# Altium project bldc_v1.PrjPcb (part 2 of 2)

## Sheet controller.SchDoc
size A4; SheetNumber: 3; SheetTotal: 4
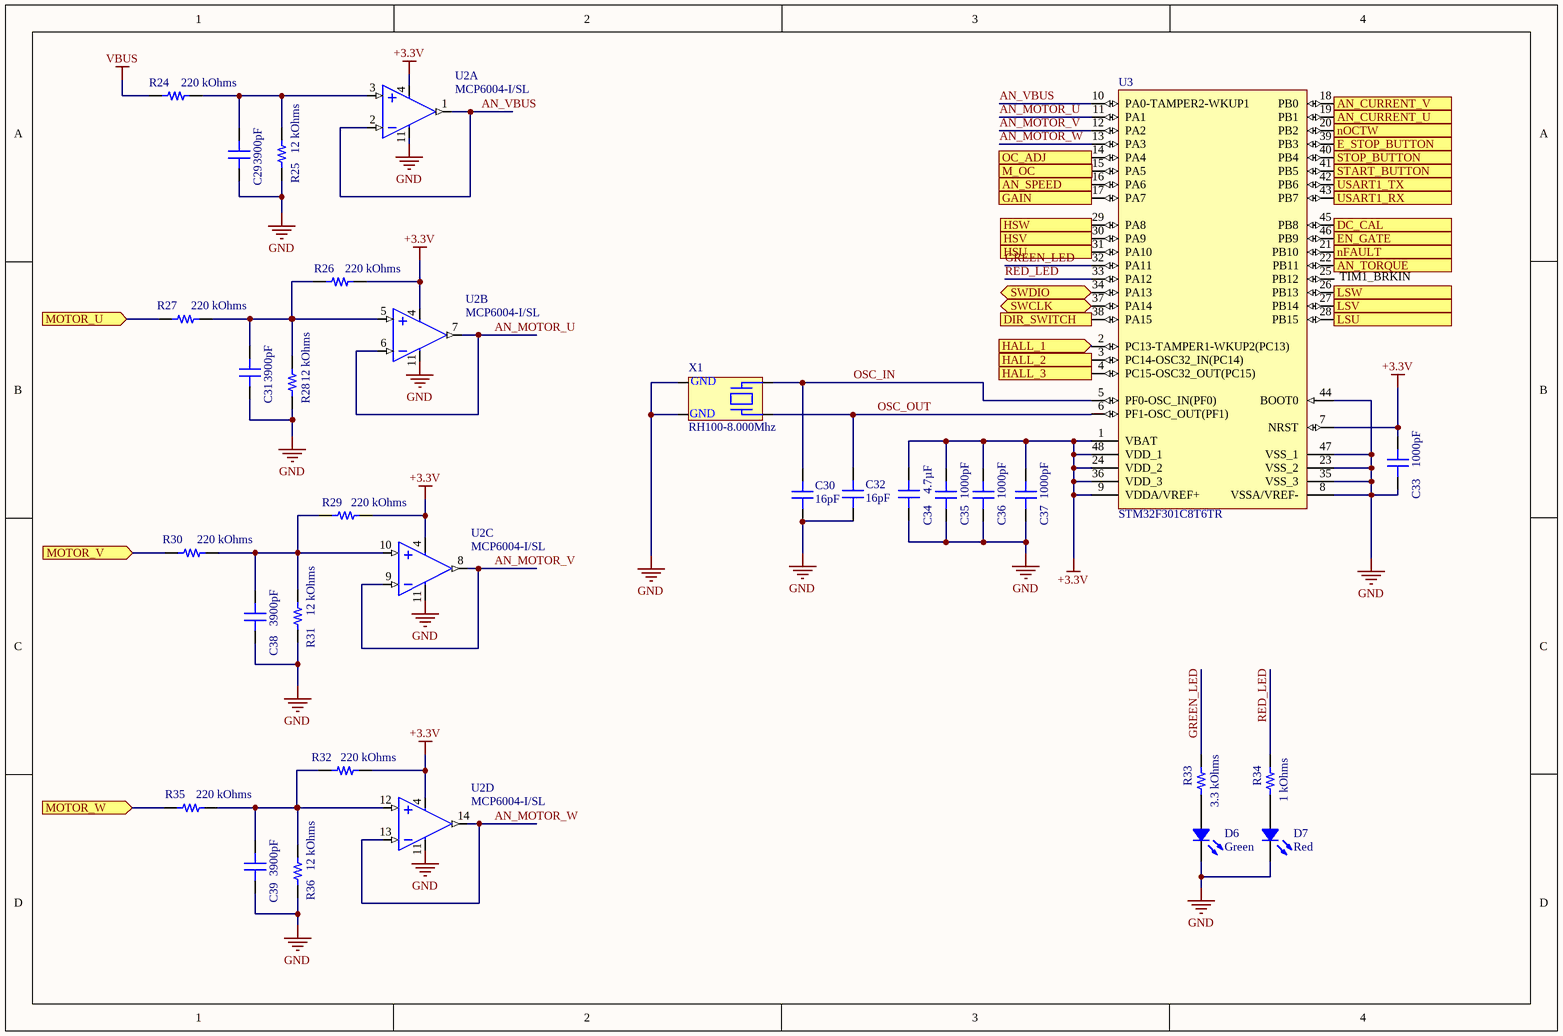
[diagram p2: controller.SchDoc]

### Parts
C29  3900pF  [CAP 0402_1005]
C30  16pF  [CAP 0402_1005]
C31  3900pF  [CAP 0402_1005]
C32  16pF  [CAP 0402_1005]
C33  1000pF  [CAP 0402_1005]
C34  4.7µF  [CAP 1206_3216 - 1.0MM]
C35  1000pF  [CAP 0402_1005]
C36  1000pF  [CAP 0402_1005]
C37  1000pF  [CAP 0402_1005]
C38  3900pF  [CAP 0402_1005]
C39  3900pF  [CAP 0402_1005]
D6  Green  [LED 1206_3216 GREEN]
D7  Red  [LED 1206_3216 RED]
R24  220 kOhms  [RES 1206_3216]
R25  12 kOhms  [RES 1206_3216]
R26  220 kOhms  [RES 1206_3216]
R27  220 kOhms  [RES 1206_3216]
R28  12 kOhms  [RES 1206_3216]
R29  220 kOhms  [RES 1206_3216]
R30  220 kOhms  [RES 1206_3216]
R31  12 kOhms  [RES 1206_3216]
R32  220 kOhms  [RES 1206_3216]
R33  3.3 kOhms  [RES 1206_3216]
R34  1 kOhms  [RES 1206_3216]
R35  220 kOhms  [RES 1206_3216]
R36  12 kOhms  [RES 1206_3216]
U2  MCP6004-I/SL  [SOIC-SL14_N]  (parts A,B,C,D of 4)
U3  STM32F301C8T6TR  [STM-LQFP48_H]
X1  RH100-8.000Mhz  [RH100-8.000]

### Ports
AN_CURRENT_U (in), AN_CURRENT_V (in), AN_SPEED (in), AN_TORQUE (in), DC_CAL (out), DIR_SWITCH (in), E_STOP_BUTTON (in), EN_GATE (out), GAIN (out), HALL_1 (in), HALL_2 (in), HALL_3 (in), HSU (out), HSV (out), HSW (out), LSU (out), LSV (out), LSW (out), M_OC (out), MOTOR_U (in), MOTOR_V (in), MOTOR_W (in), nFAULT (in), nOCTW (in), OC_ADJ (out), START_BUTTON (in), STOP_BUTTON (in), SWCLK (bidir), SWDIO (bidir), USART1_RX (in), USART1_TX (out)

### Nets
+3.3V: C33.2 C34.2 C35.2 C36.2 C37.2 R26.1 R29.1 R32.1 U2.4(VDD) U3.1(VBAT) U3.7(NRST) U3.9(VDDA/VREF+) U3.24(VDD_2) U3.36(VDD_3) U3.48(VDD_1)
GND: C29.1 C30.2 C31.1 C32.2 C33.1 C34.1 C35.1 C36.1 C37.1 C38.1 C39.1 D6.2 D7.2 R25.1 R28.1 R31.1 R36.1 U2.11(VSS) U3.8(VSSA/VREF-) U3.23(VSS_2) U3.35(VSS_3) U3.44(BOOT0) U3.47(VSS_1) X1.1(GND) X1.3(GND)
VBUS: R24.2
AN_MOTOR_U: U2.6(VINB-) U2.7(VOUTB) U3.11(PA1)
AN_MOTOR_V: U2.8(VOUTC) U2.9(VINC-) U3.12(PA2)
AN_MOTOR_W: U2.13(VIND-) U2.14(VOUTD) U3.13(PA3)
AN_VBUS: U2.1(VOUTA) U2.2(VINA-) U3.10(PA0-TAMPER2-WKUP1)
GREEN_LED: R33.2 U3.32(PA11)
HALL_A: U3.2(PC13-TAMPER1-WKUP2(PC13)) ; port HALL_1
HALL_B: U3.3(PC14-OSC32_IN(PC14)) ; port HALL_2
HALL_C: U3.4(PC15-OSC32_OUT(PC15)) ; port HALL_3
M_U: R27.2 ; port MOTOR_U
M_V: R30.2 ; port MOTOR_V
M_W: R35.2 ; port MOTOR_W
OSC_IN: C30.1 U3.5(PF0-OSC_IN(PF0)) X1.4(X1)
OSC_OUT: C32.1 U3.6(PF1-OSC_OUT(PF1)) X1.2(X2)
RED_LED: R34.2 U3.33(PA12)
NetC29_2: C29.2 R24.1 R25.2 U2.3(VINA+)
NetC31_2: C31.2 R26.2 R27.1 R28.2 U2.5(VINB+)
NetC38_2: C38.2 R29.2 R30.1 R31.2 U2.10(VINC+)
NetC39_2: C39.2 R32.2 R35.1 R36.2 U2.12(VIND+)
NetC40_2: U3.16(PA6) ; port AN_SPEED
NetC41_2: U3.22(PB11) ; port AN_TORQUE
NetCON1_3: U3.14(PA4) ; port OC_ADJ
NetCON9_1: U3.34(PA13) ; port SWDIO
NetCON9_3: U3.37(PA14) ; port SWCLK
NetD6_1: D6.1 R33.1
NetD7_1: D7.1 R34.1
NetIC1_5: U3.20(PB2) ; port nOCTW
NetIC1_6: U3.21(PB10) ; port nFAULT
NetIC1_9: U3.15(PA5) ; port M_OC
NetIC1_10: U3.17(PA7) ; port GAIN
NetIC1_12: U3.45(PB8) ; port DC_CAL
NetIC1_16: U3.46(PB9) ; port EN_GATE
NetIC1_17: U3.31(PA10) ; port HSU
NetIC1_18: U3.28(PB15) ; port LSU
NetIC1_19: U3.29(PA8) ; port HSW
NetIC1_20: U3.26(PB13) ; port LSW
NetIC1_21: U3.30(PA9) ; port HSV
NetIC1_22: U3.27(PB14) ; port LSV
NetIC1_25: U3.19(PB1) ; port AN_CURRENT_U
NetIC1_26: U3.18(PB0) ; port AN_CURRENT_V
NetR42_2: U3.41(PB5) ; port START_BUTTON
NetR46_2: U3.40(PB4) ; port STOP_BUTTON
NetR50_2: U3.39(PB3) ; port E_STOP_BUTTON
NetR52_2: U3.38(PA15) ; port DIR_SWITCH
NetU3_42: U3.42(PB6) ; port USART1_TX
NetU3_43: U3.43(PB7) ; port USART1_RX

Not connected (* = marked no-connect by the designer): U3 25(PB12)

### Notes on the sheet
- (near U3) TIM1_BRKIN

### Library data of the parts
C29 C31 C38 C39 = CC0402JRX7R9BB392: CAP CER 3900PF 50V X7R 0402; Manufacturer: Yageo; Tolerance: ±5%; Part Number: CC0402JRX7R9BB392; Value: 3900pF; Applications: General Purpose; Capacitance: 3900pF; ComponentLink1Description: Datasheet; ComponentLink1URL: https://www.yageo.com/upload/media/product/productsearch/datasheet/mlcc/UPY-GPHC_X7R_6.3V-to-50V_18.pdf; ComponentLink2Description: DigiKey Link; ComponentLink2URL: http://digikey.com/product-detail/en/yageo/CC0402JRX7R9BB392/311-3771-1-ND/8024860; Device Package: 0402 (1005 Metric); LastUpdated: 9/2/2020 1:02:24 AM; Lifecycle Status: Active; Minimum Order: 1; Mounting Type: Surface Mount, MLCC; Operating Temperature: -55°C ~ 125°C; Package / Case: 0402 (1005 Metric); Packaging: TapeAndReel; PartId: 1941; Part Status: Active; Price: 0.01; Series: CC; Size / Dimension: 0.039" L x 0.020" W (1.00mm x 0.50mm); Supplier 1: DigiKey; Supplier Part Number 1: 311-3771-1-ND; Temperature Coefficient: X7R; Thickness (Max): 0.022" (0.55mm); Voltage - Rated: 50V
C30 C32 = CBR04C160F5GAC: CAP CER 16PF 50V C0G/NP0 0402; Manufacturer: KEMET; Temperature Coefficient: C0G, NP0; Tolerance: ±1%; Part Number: CBR04C160F5GAC; Value: 16pF; Applications: RF, Microwave, High Frequency; Capacitance: 16pF; ComponentLink1Description: Datasheet; ComponentLink1URL: https://api.kemet.com/component-edge/download/datasheet/CBR04C160F5GAC.pdf; ComponentLink2Description: DigiKey Link; ComponentLink2URL: http://digikey.com/product-detail/en/kemet/CBR04C160F5GAC/399-8829-1-ND/3479748; Device Package: 0402 (1005 Metric); Features: High Q, Low Loss, Ultra Low ESR; LastUpdated: 9/2/2020 1:02:25 AM; Lifecycle Status: Active; Minimum Order: 1; Mounting Type: Surface Mount, MLCC; Operating Temperature: -55°C ~ 125°C; Package / Case: 0402 (1005 Metric); Packaging: TapeAndReel; PartId: 1751; Part Status: Active; Price: 0.08; Series: CBR-SMD RF C0G; Size / Dimension: 0.039" L x 0.020" W (1.00mm x 0.50mm); Supplier 1: DigiKey; Supplier Part Number 1: 399-8829-1-ND; Thickness (Max): 0.022" (0.55mm); Voltage - Rated: 50V
C33 C35-C37 = CGJ2B2X7R1E102K050BA: CAP CER 1000PF 25V X7R 0402; Manufacturer: TDK Corporation; Tolerance: ±10%; Part Number: CGJ2B2X7R1E102K050BA; Value: 1000pF; Applications: Automotive; Capacitance: 1000pF; ComponentLink1Description: Datasheet; ComponentLink1URL: https://product.tdk.com/info/en/catalog/datasheets/mlcc_highreliability_general_en.pdf?ref_disty=digikey; ComponentLink2Description: DigiKey Link; ComponentLink2URL: http://digikey.com/product-detail/en/tdk-corporation/CGJ2B2X7R1E102K050BA/445-8072-1-ND/2812108; Device Package: 0402 (1005 Metric); LastUpdated: 9/2/2020 1:02:23 AM; Lifecycle Status: Active; Minimum Order: 1; Mounting Type: Surface Mount, MLCC; Operating Temperature: -55°C ~ 125°C; Package / Case: 0402 (1005 Metric); Packaging: TapeAndReel; PartId: 2275; Part Status: Active; Price: 0.02; Ratings: AEC-Q200; Series: CGJ; Size / Dimension: 0.039" L x 0.020" W (1.00mm x 0.50mm); Supplier 1: DigiKey; Supplier Part Number 1: 445-8072-1-ND; Temperature Coefficient: X7R; Thickness (Max): 0.022" (0.55mm); Voltage - Rated: 25V
C34 = C3216X7R1E475K085AB: CAP CER 4.7UF 25V X7R 1206; Manufacturer: TDK Corporation; Tolerance: ±10%; Part Number: C3216X7R1E475K085AB; Value: 4.7µF; Applications: General Purpose; Capacitance: 4.7µF; ComponentLink1Description: Datasheet; ComponentLink1URL: https://product.tdk.com/info/en/catalog/datasheets/mlcc_commercial_general_en.pdf?ref_disty=digikey; ComponentLink2Description: DigiKey Link; ComponentLink2URL: http://digikey.com/product-detail/en/tdk-corporation/C3216X7R1E475K085AB/445-14797-1-ND/3956463; Device Package: 1206 (3216 Metric); Features: Low ESL; LastUpdated: 9/2/2020 1:05:06 AM; Lifecycle Status: Active; Minimum Order: 1; Mounting Type: Surface Mount, MLCC; Operating Temperature: -55°C ~ 125°C; Package / Case: 1206 (3216 Metric); Packaging: TapeAndReel; PartId: 19105; Part Status: Active; Price: 0.08; Series: C; Size / Dimension: 0.126" L x 0.063" W (3.20mm x 1.60mm); Supplier 1: DigiKey; Supplier Part Number 1: 445-14797-1-ND; Temperature Coefficient: X7R; Thickness (Max): 0.039" (1.00mm); Voltage - Rated: 25V
D6 = SML-LX1206SUGC-TR: LED GREEN CLEAR 1206 SMD; Manufacturer: Lumex Opto/Components Inc.; Configuration: Standard; Current - Test: 20mA; Lens Color: Colorless; Lens Size: 2.00mm x 1.50mm; Lens Style: Rectangle with Flat Top; Millicandela Rating: 45mcd; Viewing Angle: 140°; Voltage - Forward (Vf) (Typ): 2.2V; Wavelength - Peak: 574nm; Part Number: SML-LX1206SUGC-TR; Color: Green; ComponentLink1Description: Datasheet; ComponentLink1URL: https://www.lumex.com/content/files/ProductAttachment/SML-LX1206SUGC-TR.pdf; ComponentLink2Description: DigiKey Link; ComponentLink2URL: http://digikey.com/product-detail/en/lumex-opto-components-inc/SML-LX1206SUGC-TR/67-1698-1-ND/467582; Device Package: 1206 (3216 Metric); Height (Max): 1.10mm; LastUpdated: 9/2/2020 1:20:47 AM; Lens Transparency: Clear; Lifecycle Status: Active; Minimum Order: 1; Mounting Type: Surface Mount; Package / Case: 1206 (3216 Metric); Packaging: TapeAndReel; PartId: 530; Part Status: Active; Price: 0.09; Series: -; Size / Dimension: 3.20mm L x 1.60mm W; Supplier 1: DigiKey; Supplier Part Number 1: 67-1698-1-ND; Supplier Device Package: 1206; Value: Green
D7 = AP3216SURCK: LED RED CLEAR CHIP SMD; Manufacturer: Kingbright; Configuration: Standard; Current - Test: 20mA; Lens Color: Colorless; Lens Size: 2.00mm x 1.60mm; Lens Style: Rectangle with Flat Top; Millicandela Rating: 80mcd; Viewing Angle: 120°; Voltage - Forward (Vf) (Typ): 1.95V; Wavelength - Dominant: 630nm; Wavelength - Peak: 650nm; Part Number: AP3216SURCK; Color: Red; ComponentLink1Description: Datasheet; ComponentLink1URL: http://www.kingbrightusa.com/images/catalog/SPEC/AP3216SURCK.pdf; ComponentLink2Description: DigiKey Link; ComponentLink2URL: http://digikey.com/product-detail/en/kingbright/AP3216SURCK/754-2162-1-ND/7708877; Device Package: 1206 (3216 Metric); Height (Max): 1.10mm; LastUpdated: 9/2/2020 1:21:09 AM; Lens Transparency: Clear; Lifecycle Status: Active; Minimum Order: 1; Mounting Type: Surface Mount; Package / Case: 1206 (3216 Metric); Packaging: TapeAndReel; PartId: 191; Part Status: Active; Price: 0.07; Series: -; Size / Dimension: 3.20mm L x 1.60mm W; Supplier 1: DigiKey; Supplier Part Number 1: 754-2162-1-ND; Supplier Device Package: Chip LED; Value: Red
R24 R26 R27 R29 R30 R32 R35 = AC1206FR-07220KL: RES SMD 220K OHM 1% 1/4W 1206; Manufacturer: Yageo; Power (Watts): 0.25W, 1/4W; Temperature Coefficient: ±100ppm/°C; Part Number: AC1206FR-07220KL; ComponentLink1Description: Datasheet; ComponentLink1URL: https://www.yageo.com/upload/media/product/productsearch/datasheet/rchip/PYu-AC_51_RoHS_L_7.pdf; ComponentLink2Description: DigiKey Link; ComponentLink2URL: http://digikey.com/product-detail/en/yageo/AC1206FR-07220KL/YAG3843CT-ND/6006692; Composition: Thick Film; Device Package: 1206 (3216 Metric); Features: Automotive AEC-Q200, Moisture Resistant; Height - Seated (Max): 0.026" (0.65mm); LastUpdated: 9/2/2020 1:13:08 AM; Lifecycle Status: Active; Minimum Order: 1; Number of Terminations: 2; Operating Temperature: -55°C ~ 155°C; Package / Case: 1206 (3216 Metric); Packaging: TapeAndReel; PartId: 27550; Part Status: Active; Price: 0.01; Ratings: AEC-Q200; Resistance: 220 kOhms; Series: AC; Size / Dimension: 0.122" L x 0.063" W (3.10mm x 1.60mm); Supplier 1: DigiKey; Supplier Part Number 1: YAG3843CT-ND; Supplier Device Package: 1206; Tolerance: ±1%; Value: 220 kOhms
R25 R28 R31 R36 = RMCF1206FT12K0: RES 12K OHM 1% 1/4W 1206; Manufacturer: Stackpole Electronics Inc; Power (Watts): 0.25W, 1/4W; Temperature Coefficient: ±100ppm/°C; Part Number: RMCF1206FT12K0; ComponentLink1Description: Datasheet; ComponentLink1URL: https://www.seielect.com/catalog/sei-rmcf_rmcp.pdf; ComponentLink2Description: DigiKey Link; ComponentLink2URL: http://digikey.com/product-detail/en/stackpole-electronics-inc/RMCF1206FT12K0/RMCF1206FT12K0CT-ND/2418564; Composition: Thick Film; Device Package: 1206 (3216 Metric); Features: Automotive AEC-Q200; Height - Seated (Max): 0.028" (0.70mm); LastUpdated: 9/2/2020 1:13:11 AM; Lifecycle Status: Active; Minimum Order: 1; Number of Terminations: 2; Operating Temperature: -55°C ~ 155°C; Package / Case: 1206 (3216 Metric); Packaging: CutTape; PartId: 26918; Part Status: Active; Price: 0.10; Ratings: AEC-Q200; Resistance: 12 kOhms; Series: RMCF; Size / Dimension: 0.126" L x 0.063" W (3.20mm x 1.60mm); Supplier 1: DigiKey; Supplier Part Number 1: RMCF1206FT12K0CT-ND; Supplier Device Package: 1206; Tolerance: ±1%; Value: 12 kOhms
R33 = CRCW12063K30FKEA: RES SMD 3.3K OHM 1% 1/4W 1206; Manufacturer: Vishay Dale; Power (Watts): 0.25W, 1/4W; Temperature Coefficient: ±100ppm/°C; Part Number: CRCW12063K30FKEA; ComponentLink1Description: Datasheet; ComponentLink1URL: http://www.vishay.com/docs/20035/dcrcwe3.pdf; ComponentLink2Description: DigiKey Link; ComponentLink2URL: http://digikey.com/product-detail/en/vishay-dale/CRCW12063K30FKEA/541-3.30KFCT-ND/1181817; Composition: Thick Film; Device Package: 1206 (3216 Metric); Features: Automotive AEC-Q200; Height - Seated (Max): 0.024" (0.60mm); LastUpdated: 9/2/2020 1:13:06 AM; Lifecycle Status: Active; Minimum Order: 1; Number of Terminations: 2; Operating Temperature: -55°C ~ 155°C; Package / Case: 1206 (3216 Metric); Packaging: TapeAndReel; PartId: 28070; Part Status: Active; Price: 0.01; Ratings: AEC-Q200; Resistance: 3.3 kOhms; Series: CRCW; Size / Dimension: 0.126" L x 0.063" W (3.20mm x 1.60mm); Supplier 1: DigiKey; Supplier Part Number 1: 541-3.30KFCT-ND; Supplier Device Package: 1206; Tolerance: ±1%; Value: 3.3 kOhms
R34 = RC1206FR-071KL: RES SMD 1K OHM 1% 1/4W 1206; Manufacturer: Yageo; Power (Watts): 0.25W, 1/4W; Temperature Coefficient: ±100ppm/°C; Part Number: RC1206FR-071KL; ComponentLink1Description: Datasheet; ComponentLink1URL: https://www.yageo.com/upload/media/product/productsearch/datasheet/rchip/PYu-RC_Group_51_RoHS_L_10.pdf; ComponentLink2Description: DigiKey Link; ComponentLink2URL: http://digikey.com/product-detail/en/yageo/RC1206FR-071KL/311-1.00KFRCT-ND/731334; Composition: Thick Film; Device Package: 1206 (3216 Metric); Features: Moisture Resistant; Height - Seated (Max): 0.026" (0.65mm); LastUpdated: 9/2/2020 1:13:10 AM; Lifecycle Status: Active; Minimum Order: 1; Number of Terminations: 2; Operating Temperature: -55°C ~ 155°C; Package / Case: 1206 (3216 Metric); Packaging: TapeAndReel; PartId: 26978; Part Status: Active; Price: 0.01; Resistance: 1 kOhms; Series: RC; Size / Dimension: 0.122" L x 0.063" W (3.10mm x 1.60mm); Supplier 1: DigiKey; Supplier Part Number 1: 311-1.00KFRCT-ND; Supplier Device Package: 1206; Tolerance: ±1%; Value: 1 kOhms
U2 = MCP6004: 1 MHz, Low-Power Operational Amplifier, 14-Pin SOIC, Industrial Temperature; ComponentLink2Description: Datasheet; Code_JEDEC: MS-012-AB; PackageVersion: revBB, Aug-2009; Code_IPC: SOIC127P600-14; ComponentLink2URL: http://ww1.microchip.com/downloads/en/DeviceDoc/21733j.pdf; ComponentLink1Description: Manufacturer URL; ComponentLink1URL: http://www.microchip.com/; RevisionNote: URLs added.; ComponentLink3URL: http://www.microchip.com/stellent/groups/techpub_sg/documents/packagingspec/en012702.pdf; PackageReference: SOIC-SL14; PackageDescription: 14-Lead Plastic Small Outline (SL) - Narrow, 3.90mm Body [SOIC]; ComponentLink3Description: Package Specification; DatasheetVersion: revJ, Nov-2009
U3 = STM32F301C8T6: ARM Cortex-M4 32-bit MCU, 64 KB Flash, 16 KB Internal RAM, 37 I/Os, 48-Pin LQFP, -40 to 85 degC, Tape and Reel; FLASH Size (Prog) (kB): 64; Internal RAM Size (kB): 16; D/A Converter: 1; Operating Frequency(F) (Processor speed) (MHz): 72; Supply Voltage(Vcc) min (V): 2; I/Os (High Current): 37; ComponentLink2Description: Datasheet; ComponentLink1URL: http://www.st.com/; Package Description: 48-Pin Low Profile Quad Flat Package, Body 7 x 7 mm, Pitch 0.5 mm; ComponentLink1Description: Manufacturer URL; ComponentLink2URL: http://www.st.com/st-web-ui/static/active/en/resource/technical/document/datasheet/DM00093332.pdf; Mounting Technology: Surface Mount; Packing: Tape and Reel; DatasheetVersion: Rev. 6; Package Reference: LQFP48; Core: ARM Cortex-M4

## Sheet connections.SchDoc
size A4; SheetNumber: 4; SheetTotal: 4
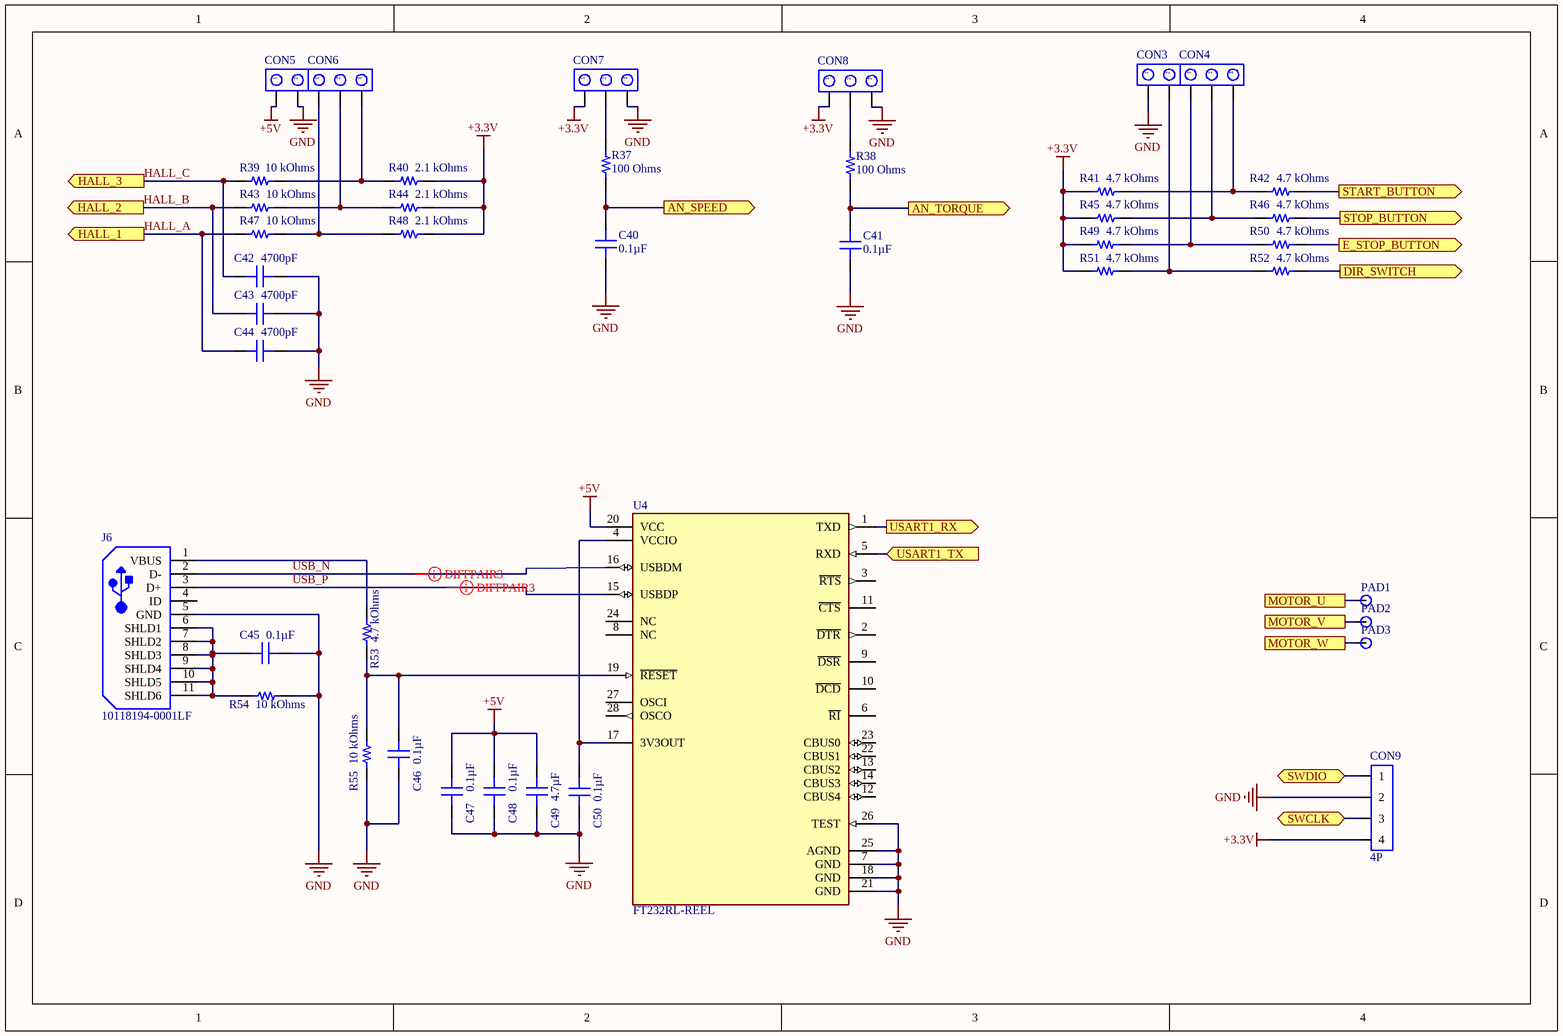
[diagram p3: connections.SchDoc]

### Parts
C40  0.1µF  [CAP 0402_1005]
C41  0.1µF  [CAP 0402_1005]
C42  4700pF  [CAP 0603_1608]
C43  4700pF  [CAP 0603_1608]
C44  4700pF  [CAP 0603_1608]
C45  0.1µF  [CAP 0402_1005]
C46  0.1µF  [CAP 0402_1005]
C47  0.1µF  [CAP 0402_1005]
C48  0.1µF  [CAP 0402_1005]
C49  4.7µF  [CAP 1206_3216 - 1.0MM]
C50  0.1µF  [CAP 0402_1005]
CON3  DG301-5.0-02P-12-00AH  [DG301-5.0-02P-12-00AH]  (value not drawn)
CON4  DG301-5.0-03P-12-00AH  [DG301-5.0-03P-12-00AH]  (value not drawn)
CON5  DG301-5.0-02P-12-00AH  [DG301-5.0-02P-12-00AH]  (value not drawn)
CON6  DG301-5.0-03P-12-00AH  [DG301-5.0-03P-12-00AH]  (value not drawn)
CON7  DG301-5.0-03P-12-00AH  [DG301-5.0-03P-12-00AH]  (value not drawn)
CON8  DG301-5.0-03P-12-00AH  [DG301-5.0-03P-12-00AH]  (value not drawn)
CON9  4P  [Single_THT_4P_2.54Pitch_6Height_180C]
J6  10118194-0001LF  [FCI-10118194-0001LF-5_V]
PAD1  Single Pad 4mm  [PCBComponent_1]  (value not drawn)
PAD2  Single Pad 4mm  [PCBComponent_1]  (value not drawn)
PAD3  Single Pad 4mm  [PCBComponent_1]  (value not drawn)
R37  100 Ohms  [RES 1206_3216]
R38  100 Ohms  [RES 1206_3216]
R39  10 kOhms  [RES 1206_3216]
R40  2.1 kOhms  [RES 1206_3216]
R41  4.7 kOhms  [RES 1206_3216]
R42  4.7 kOhms  [RES 1206_3216]
R43  10 kOhms  [RES 1206_3216]
R44  2.1 kOhms  [RES 1206_3216]
R45  4.7 kOhms  [RES 1206_3216]
R46  4.7 kOhms  [RES 1206_3216]
R47  10 kOhms  [RES 1206_3216]
R48  2.1 kOhms  [RES 1206_3216]
R49  4.7 kOhms  [RES 1206_3216]
R50  4.7 kOhms  [RES 1206_3216]
R51  4.7 kOhms  [RES 1206_3216]
R52  4.7 kOhms  [RES 1206_3216]
R53  4.7 kOhms  [RES 1206_3216]
R54  10 kOhms  [RES 1206_3216]
R55  10 kOhms  [RES 1206_3216]
U4  FT232RL-REEL  [FP-SSOP-28-IPC_B]

### Ports
AN_SPEED (out), AN_TORQUE (out), DIR_SWITCH (out), E_STOP_BUTTON (out), HALL_1 (out), HALL_2 (out), HALL_3 (out), MOTOR_U, MOTOR_V, MOTOR_W, START_BUTTON (out), STOP_BUTTON (out), SWCLK (bidir), SWDIO (bidir), USART1_RX (out), USART1_TX (in)

### Nets
+3.3V: CON7.1 CON8.1 CON9.4 R40.1 R41.1 R44.1 R45.1 R48.1 R49.1 R51.1
+5V: C47.2 C48.2 C49.2 CON5.1 U4.20(VCC)
GND: C40.1 C41.1 C42.1 C43.1 C44.1 C45.1 C46.1 C47.1 C48.1 C49.1 C50.1 CON3.1 CON5.2 CON7.3 CON8.3 CON9.2 J6.5(GND) R54.1 R55.1 U4.7(GND) U4.18(GND) U4.21(GND) U4.25(AGND) U4.26(TEST)
HALL_A: C44.2 R47.2 ; port HALL_1
HALL_B: C43.2 R43.2 ; port HALL_2
HALL_C: C42.2 R39.2 ; port HALL_3
M_U: PAD1.1 ; port MOTOR_U
M_V: PAD2.1 ; port MOTOR_V
M_W: PAD3.1 ; port MOTOR_W
USB_N: J6.2(D-) U4.16(USBDM)
USB_P: J6.3(D+) U4.15(USBDP)
NetC40_2: C40.2 R37.1 ; port AN_SPEED
NetC41_2: C41.2 R38.1 ; port AN_TORQUE
NetC45_2: C45.2 J6.6(SHLD1) J6.7(SHLD2) J6.8(SHLD3) J6.9(SHLD4) J6.10(SHLD5) J6.11(SHLD6) R54.2
NetC46_2: C46.2 R53.1 R55.2 U4.19(~{RESET})
NetC50_2: C50.2 U4.4(VCCIO) U4.17(3V3OUT)
NetCON3_2: CON3.2 R51.2 R52.1
NetCON4_1: CON4.1 R49.2 R50.1
NetCON4_2: CON4.2 R45.2 R46.1
NetCON4_3: CON4.3 R41.2 R42.1
NetCON6_1: CON6.1 R47.1 R48.2
NetCON6_2: CON6.2 R43.1 R44.2
NetCON6_3: CON6.3 R39.1 R40.2
NetCON7_2: CON7.2 R37.2
NetCON8_2: CON8.2 R38.2
NetCON9_1: CON9.1 ; port SWDIO
NetCON9_3: CON9.3 ; port SWCLK
NetJ6_1: J6.1(VBUS) R53.2
NetR42_2: R42.2 ; port START_BUTTON
NetR46_2: R46.2 ; port STOP_BUTTON
NetR50_2: R50.2 ; port E_STOP_BUTTON
NetR52_2: R52.2 ; port DIR_SWITCH
NetU3_42: U4.5(RXD) ; port USART1_TX
NetU3_43: U4.1(TXD) ; port USART1_RX

Not connected (* = marked no-connect by the designer): J6 4(ID); U4 2(~{DTR}) 3(~{RTS}) 6(~{RI}) 8(NC) 9(~{DSR}) 10(~{DCD}) 11(~{CTS}) 12(CBUS4) 13(CBUS2) 14(CBUS3) 22(CBUS1) 23(CBUS0) 24(NC) 27(OSCI) 28(OSCO)

### Layout directives
differential pair; differential pair class USB: USB_N, USB_P

### Library data of the parts
C40 C41 C45-C48 C50 = C0402C104M4RACTU: CAP CER 0.1UF 16V X7R 0402; Manufacturer: KEMET; Tolerance: ±20%; Part Number: C0402C104M4RACTU; Value: 0.1µF; Applications: Bypass, Decoupling; Capacitance: 0.1µF; ComponentLink1Description: Datasheet; ComponentLink1URL: https://api.kemet.com/component-edge/download/datasheet/C0402C104M4RACTU.pdf; ComponentLink2Description: DigiKey Link; ComponentLink2URL: http://digikey.com/product-detail/en/kemet/C0402C104M4RACTU/399-7763-1-ND/3471486; Device Package: 0402 (1005 Metric); LastUpdated: 9/2/2020 1:02:24 AM; Lifecycle Status: Active; Minimum Order: 1; Mounting Type: Surface Mount, MLCC; Operating Temperature: -55°C ~ 125°C; Package / Case: 0402 (1005 Metric); Packaging: TapeAndReel; PartId: 2095; Part Status: Active; Price: 0.02; Series: SMD Comm X7R; Size / Dimension: 0.039" L x 0.020" W (1.00mm x 0.50mm); Supplier 1: DigiKey; Supplier Part Number 1: 399-7763-1-ND; Temperature Coefficient: X7R; Thickness (Max): 0.022" (0.55mm); Voltage - Rated: 16V
C42-C44 = C0603C472K4RECAUTO: CAP CER 0603 4.7NF 16V X7R 10%; Manufacturer: KEMET; Part Number: C0603C472K4RECAUTO; Value: 4700pF; Applications: Automotive, ESD Protection; Capacitance: 4700pF; ComponentLink1Description: Datasheet; ComponentLink1URL: https://api.kemet.com/component-edge/download/datasheet/C0603C472K4RECAUTO.pdf; ComponentLink2Description: DigiKey Link; ComponentLink2URL: http://digikey.com/product-detail/en/kemet/C0603C472K4RECAUTO/399-17879-1-ND/8640546; Device Package: 0603 (1608 Metric); LastUpdated: 9/2/2020 1:03:03 AM; Lifecycle Status: Active; Minimum Order: 1; Mounting Type: Surface Mount, MLCC; Operating Temperature: -55°C ~ 125°C; Package / Case: 0603 (1608 Metric); Packaging: TapeAndReel; PartId: 17340; Part Status: Active; Price: 0.03; Ratings: AEC-Q200; Series: ESD SMD Auto X7R; Size / Dimension: 0.063" L x 0.031" W (1.60mm x 0.80mm); Supplier 1: DigiKey; Supplier Part Number 1: 399-17879-1-ND; Temperature Coefficient: X7R; Thickness (Max): 0.034" (0.87mm); Tolerance: ±10%; Voltage - Rated: 16V
C49 = C3216X7R1E475K085AB: as C34 on sheet controller; Part Number: C3216X7R1E475K085AB; Value: 4.7µF; Applications: General Purpose; Capacitance: 4.7µF; ComponentLink1Description: Datasheet; ComponentLink1URL: https://product.tdk.com/info/en/catalog/datasheets/mlcc_commercial_general_en.pdf?ref_disty=digikey; ComponentLink2Description: DigiKey Link; ComponentLink2URL: http://digikey.com/product-detail/en/tdk-corporation/C3216X7R1E475K085AB/445-14797-1-ND/3956463; Device Package: 1206 (3216 Metric); Features: Low ESL; LastUpdated: 9/2/2020 1:05:06 AM; Lifecycle Status: Active; Minimum Order: 1; Mounting Type: Surface Mount, MLCC; Operating Temperature: -55°C ~ 125°C; Package / Case: 1206 (3216 Metric); Packaging: TapeAndReel; PartId: 19105; Part Status: Active; Price: 0.08; Series: C; Size / Dimension: 0.126" L x 0.063" W (3.20mm x 1.60mm); Supplier 1: DigiKey; Supplier Part Number 1: 445-14797-1-ND; Temperature Coefficient: X7R; Thickness (Max): 0.039" (1.00mm); Voltage - Rated: 25V
CON9 = Single 4P 2.54mm
J6 = KLS1-238: Micro USB B Type Receptacle, 1.8 A, -55 to 85 degC, 5-Pin SMD, RoHS, Tape and Reel; Manufacturer: Amphenol FCI; Body Orientation: RightAngle; Number of Contacts: 5; Pitch: 0.65mm; Gender: RCP; Rad Hard: No; Package Reference: 10118194-0001LF-5; Mounting: SurfaceMount; Manufacturer URL: http://www.fci.com/; Packaging: CutTape; Datasheet URL: https://datasheet.ciiva.com/26945/getdatasheetpartid-418619-26945695.pdf; Termination Method: Solder; Package Description: 5-Pin Surface Mount Device, Body 8.05 x 5.53 mm, Pitch 0.65 mm; Type: MicroUSBTypeB; Datasheet Version: Rev. A, 10/2011
R37 R38 = CRG1206F100R: RES SMD 100 OHM 1% 1/4W 1206; Manufacturer: TE Connectivity Passive Product; Power (Watts): 0.25W, 1/4W; Temperature Coefficient: ±200ppm/°C; Part Number: CRG1206F100R; ComponentLink1Description: Datasheet; ComponentLink1URL: https://www.te.com/commerce/DocumentDelivery/DDEController?Action=srchrtrv&DocNm=1773204&DocType=DS&DocLang=English; ComponentLink2Description: DigiKey Link; ComponentLink2URL: http://digikey.com/product-detail/en/te-connectivity-passive-product/CRG1206F100R/A106068CT-ND/3477719; Composition: Thick Film; Device Package: 1206 (3216 Metric); Height - Seated (Max): 0.026" (0.65mm); LastUpdated: 9/2/2020 1:13:10 AM; Lifecycle Status: Active; Minimum Order: 1; Number of Terminations: 2; Operating Temperature: -55°C ~ 155°C; Package / Case: 1206 (3216 Metric); Packaging: TapeAndReel; PartId: 26991; Part Status: Active; Price: 0.01; Resistance: 100 Ohms; Series: CRG, Neohm; Size / Dimension: 0.122" L x 0.061" W (3.10mm x 1.55mm); Supplier 1: DigiKey; Supplier Part Number 1: A106068CT-ND; Supplier Device Package: 1206; Tolerance: ±1%; Value: 100 Ohms
R39 R43 R47 R54 R55 = CRG1206F10K: RES SMD 10K OHM 1% 1/4W 1206; Manufacturer: TE Connectivity Passive Product; Power (Watts): 0.25W, 1/4W; Temperature Coefficient: ±100ppm/°C; Part Number: CRG1206F10K; ComponentLink1Description: Datasheet; ComponentLink1URL: https://www.te.com/commerce/DocumentDelivery/DDEController?Action=srchrtrv&DocNm=1773204&DocType=DS&DocLang=English; ComponentLink2Description: DigiKey Link; ComponentLink2URL: http://digikey.com/product-detail/en/te-connectivity-passive-product/CRG1206F10K/A106069CT-ND/3477720; Composition: Thick Film; Device Package: 1206 (3216 Metric); Height - Seated (Max): 0.026" (0.65mm); LastUpdated: 9/2/2020 1:13:10 AM; Lifecycle Status: Active; Minimum Order: 1; Number of Terminations: 2; Operating Temperature: -55°C ~ 155°C; Package / Case: 1206 (3216 Metric); Packaging: TapeAndReel; PartId: 26989; Part Status: Active; Price: 0.01; Resistance: 10 kOhms; Series: CRG, Neohm; Size / Dimension: 0.122" L x 0.061" W (3.10mm x 1.55mm); Supplier 1: DigiKey; Supplier Part Number 1: A106069CT-ND; Supplier Device Package: 1206; Tolerance: ±1%; Value: 10 kOhms
R40 R44 R48 = RC1206FR-072K1L: RES SMD 2.1K OHM 1% 1/4W 1206; Manufacturer: Yageo; Power (Watts): 0.25W, 1/4W; Temperature Coefficient: ±100ppm/°C; Part Number: RC1206FR-072K1L; ComponentLink1Description: Datasheet; ComponentLink1URL: https://www.yageo.com/upload/media/product/productsearch/datasheet/rchip/PYu-RC_Group_51_RoHS_L_10.pdf; ComponentLink2Description: DigiKey Link; ComponentLink2URL: http://digikey.com/product-detail/en/yageo/RC1206FR-072K1L/311-2.10KFRCT-ND/731565; Composition: Thick Film; Device Package: 1206 (3216 Metric); Features: Moisture Resistant; Height - Seated (Max): 0.026" (0.65mm); LastUpdated: 9/2/2020 1:12:56 AM; Lifecycle Status: Active; Minimum Order: 1; Number of Terminations: 2; Operating Temperature: -55°C ~ 155°C; Package / Case: 1206 (3216 Metric); Packaging: TapeAndReel; PartId: 32511; Part Status: Active; Price: 0.01; Resistance: 2.1 kOhms; Series: RC; Size / Dimension: 0.122" L x 0.063" W (3.10mm x 1.60mm); Supplier 1: DigiKey; Supplier Part Number 1: 311-2.10KFRCT-ND; Supplier Device Package: 1206; Tolerance: ±1%; Value: 2.1 kOhms
R41 R42 R45 R46 R49-R53 = CRG1206F4K7: RES SMD 4.7K OHM 1% 1/4W 1206; Manufacturer: TE Connectivity Passive Product; Power (Watts): 0.25W, 1/4W; Temperature Coefficient: ±100ppm/°C; Part Number: CRG1206F4K7; ComponentLink1Description: Datasheet; ComponentLink1URL: https://www.te.com/commerce/DocumentDelivery/DDEController?Action=srchrtrv&DocNm=1773204&DocType=DS&DocLang=English; ComponentLink2Description: DigiKey Link; ComponentLink2URL: http://digikey.com/product-detail/en/te-connectivity-passive-product/CRG1206F4K7/A106078CT-ND/3477735; Composition: Thick Film; Device Package: 1206 (3216 Metric); Height - Seated (Max): 0.026" (0.65mm); LastUpdated: 9/2/2020 1:13:10 AM; Lifecycle Status: Active; Minimum Order: 1; Number of Terminations: 2; Operating Temperature: -55°C ~ 155°C; Package / Case: 1206 (3216 Metric); Packaging: TapeAndReel; PartId: 26987; Part Status: Active; Price: 0.01; Resistance: 4.7 kOhms; Series: CRG, Neohm; Size / Dimension: 0.122" L x 0.061" W (3.10mm x 1.55mm); Supplier 1: DigiKey; Supplier Part Number 1: A106078CT-ND; Supplier Device Package: 1206; Tolerance: ±1%; Value: 4.7 kOhms
U4 = FT232R: IC USB FS SERIAL UART 28-SSOP; Data Rate: 12Mbps; Max Supply Voltage: 5.25V; Operating Supply Current: 15mA; Number of Channels: 1; Voltage: 5V; Min Supply Voltage: 3.3V; Radiation Hardening: No; Mount: Surface Mount; Min Operating Temperature: -40°C; Package Quantity: 2000; Number of Transceivers: 1; Width: 5.3mm; Number of Pins: 28; Height: 1.75mm; Weight: 0.080001oz; Lead Free: Lead Free; Length: 10.2mm; REACH SVHC: No SVHC; Max Operating Temperature: 85°C; Packaging: Tape and Reel; Interface: UART; Case/Package: SSOP

## Nets that join several sheets
+3.3V: driver section (IC1.24 R4.2 R5.2), power stage (C23.1 D5.2 U1.1), controller (15 pins), connections (10 pins)
+5V: driver section (C2.2 L1.2 R1.2 R2.2), power stage (C21.2 C22.2 U1.3 U1.4), connections (5 pins)
GND: driver section (24 pins), power stage (18 pins), controller (25 pins), connections (24 pins)
HV: driver section (5 pins), power stage (C18.2 D3.2 D4.2)
VBUS: driver section (C6.2 C7.2 C8.2 IC1.29), power stage (8 pins), controller (R24.2)
HALL_A: controller (U3.2), connections (C44.2 R47.2)
HALL_B: controller (U3.3), connections (C43.2 R43.2)
HALL_C: controller (U3.4), connections (C42.2 R39.2)
M_U: power stage (C17.1 IC1.46 Q1.3 Q2.2), controller (R27.2), connections (PAD1.1)
M_V: power stage (C20.1 IC1.36 Q3.3 Q4.2), controller (R30.2), connections (PAD2.1)
M_W: power stage (C26.1 IC1.41 Q5.3 Q6.2), controller (R35.2), connections (PAD3.1)
NetC40_2: controller (U3.16), connections (C40.2 R37.1)
NetC41_2: controller (U3.22), connections (C41.2 R38.1)
NetCON1_3: driver section (CON1.3), controller (U3.14)
NetCON9_1: controller (U3.34), connections (CON9.1)
NetCON9_3: controller (U3.37), connections (CON9.3)
NetIC1_5: driver section (IC1.5 R5.1), controller (U3.20)
NetIC1_6: driver section (IC1.6 R4.1), controller (U3.21)
NetIC1_9: driver section (IC1.9), controller (U3.15)
NetIC1_10: driver section (IC1.10), controller (U3.17)
NetIC1_12: driver section (IC1.12), controller (U3.45)
NetIC1_16: driver section (IC1.16), controller (U3.46)
NetIC1_17: power stage (IC1.17), controller (U3.31)
NetIC1_18: power stage (IC1.18), controller (U3.28)
NetIC1_19: power stage (IC1.19), controller (U3.29)
NetIC1_20: power stage (IC1.20), controller (U3.26)
NetIC1_21: power stage (IC1.21), controller (U3.30)
NetIC1_22: power stage (IC1.22), controller (U3.27)
NetIC1_25: driver section (IC1.25), controller (U3.19)
NetIC1_26: driver section (IC1.26), controller (U3.18)
NetR42_2: controller (U3.41), connections (R42.2)
NetR46_2: controller (U3.40), connections (R46.2)
NetR50_2: controller (U3.39), connections (R50.2)
NetR52_2: controller (U3.38), connections (R52.2)
NetU3_42: controller (U3.42), connections (U4.5)
NetU3_43: controller (U3.43), connections (U4.1)
SHUNT_1_N: driver section (IC1.32), power stage (C25.1 J2.1)
SHUNT_1_P: driver section (IC1.33), power stage (C25.2 J1.1)
SHUNT_2_N: driver section (IC1.30), power stage (C28.1 J4.1)
SHUNT_2_P: driver section (IC1.31), power stage (C28.2 J3.1)